# EAGLE design angle_led (EAGLE 9.6.2)
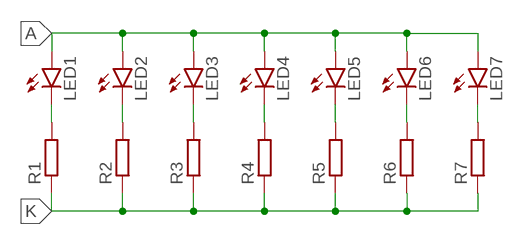
[diagram p0: schematic, sheet 1]

## Parts
LED1  LED5MM  [LED5MM]
LED2  LED5MM  [LED5MM]
LED3  LED5MM  [LED5MM]
LED4  LED5MM  [LED5MM]
LED5  LED5MM  [LED5MM]
LED6  LED5MM  [LED5MM]
LED7  LED5MM  [LED5MM]
R1  R-EU_R0603  [R0603]
R2  R-EU_R0603  [R0603]
R3  R-EU_R0603  [R0603]
R4  R-EU_R0603  [R0603]
R5  R-EU_R0603  [R0603]
R6  R-EU_R0603  [R0603]
R7  R-EU_R0603  [R0603]

## Nets
A: LED1.A LED2.A LED3.A LED4.A LED5.A LED6.A LED7.A
K: R1.1 R2.1 R3.1 R4.1 R5.1 R6.1 R7.1
N$1: LED1.K(C) R1.2
N$2: LED2.K(C) R2.2
N$3: LED3.K(C) R3.2
N$4: LED4.K(C) R4.2
N$5: LED5.K(C) R5.2
N$6: LED6.K(C) R6.2
N$7: LED7.K(C) R7.2

## Library data of the parts
LED1-LED7 = led:LED: LED OSRAM: - CHIPLED LG R971, LG N971, LY N971, LG Q971, LY Q971, LO R971, LY R971 LH N974, LH R974 LS Q976, LO Q976, LY Q976 LO Q996 - Hyper CHIPLED LW Q18S LB Q993, LB Q99A, LB R99A - SideLED LS A670, LO A670, LY A670, LG A670, LP A670 LB A673, LV A673, LT A673, LW A673 LH A674 LY A675 LS A676, LA A676, LO A676, LY A676, LW A676 LS A679, LY A679, LG A679 - Hyper Micro SIDELED® LS Y876, LA Y876, LO Y876, LY Y876 LT Y87S - SmartLED LW L88C, LW L88S LB L89C, LB L89S, LG L890 LS L89K, LO L89K, LY L89K LS L896, LA L896, LO L896, LY L896 - TOPLED LS T670, LO T670, LY T670, LG T670, LP T670 LSG T670, LSP T670, LSY T670, LOP T670, LYG T670 LG T671, LOG T671, LSG T671 LB T673, LV T673, LT T673, LW T673 LH T674 LS T676, LA T676, LO T676, LY T676, LB T676, LH T676, LSB T676, LW T676 LB T67C, LV T67C, LT T67C, LS T67K, LO T67K, LY T67K, LW E67C LS E67B, LA E67B, LO E67B, LY E67B, LB E67C, LV E67C, LT E67C LW T67C LS T679, LY T679, LG T679 LS T770, LO T770, LY T770, LG T770, LP T770 LB T773, LV T773, LT T773, LW T773 LH T774 LS E675, LA E675, LY E675, LS T675 LS T776, LA T776, LO T776, LY T776, LB T776 LHGB T686 LT T68C, LB T68C - Hyper Mini TOPLED® LB M676 - Mini TOPLED Santana® LG M470 LS M47K, LO M47K, LY M47K Source: http://www.osram.convergy.de LUXEON: - LUMILED® LXK2-PW12-R00, LXK2-PW12-S00, LXK2-PW14-U00, LXK2-PW14-V00 LXK2-PM12-R00, LXK2-PM12-S00, LXK2-PM14-U00 LXK2-PE12-Q00, LXK2-PE12-R00, LXK2-PE12-S00, LXK2-PE14-T00, LXK2-PE14-U00 LXK2-PB12-K00, LXK2-PB12-L00, LXK2-PB12-M00, LXK2-PB14-N00, LXK2-PB14-P00, LXK2-PB14-Q00 LXK2-PR12-L00, LXK2-PR12-M00, LXK2-PR14-Q00, LXK2-PR14-R00 LXK2-PD12-Q00, LXK2-PD12-R00, LXK2-PD12-S00 LXK2-PH12-R00, LXK2-PH12-S00 LXK2-PL12-P00, LXK2-PL12-Q00, LXK2-PL12-R00 Source: www.luxeon.com KINGBRIGHT: KA-3528ASYC Source: www.kingbright.com
R1-R7 = rcl:R-EU_: RESISTOR, European symbol; SPICEPREFIX: R

## Board
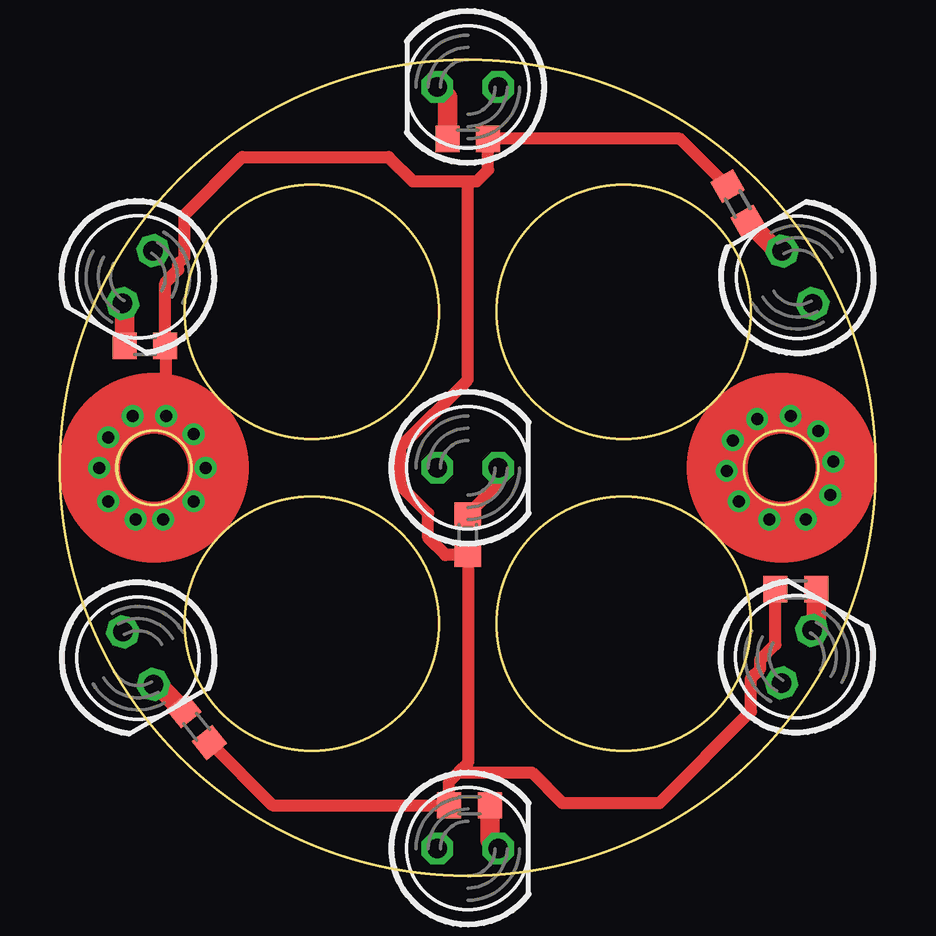
[diagram p1: board, top side]
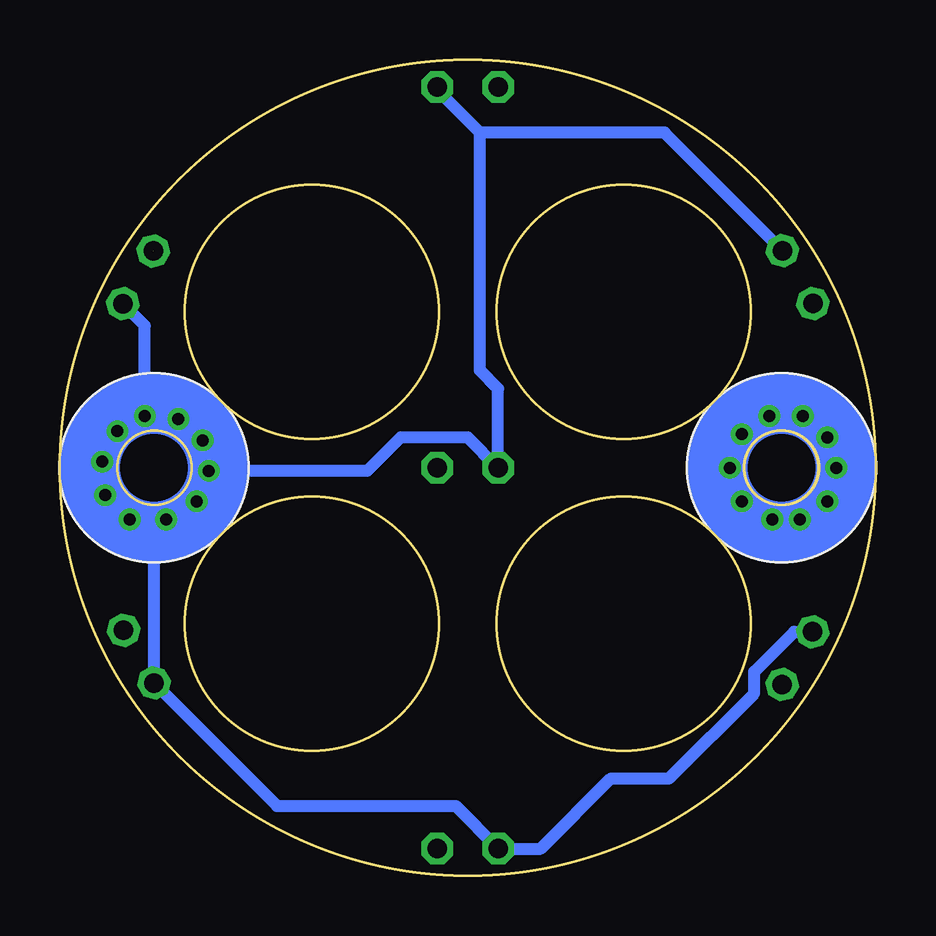
[diagram p2: board, bottom side, seen from below]

Size 34 x 34 mm. Coordinates in mm from the lower left corner, seen from the top.
Outline: circle at 30.06,17 radius 1.55
Outline: circle at 3.94,17 radius 1.55
Outline: circle at 10.5,23.5 radius 5.3
Outline: circle at 23.5,23.5 radius 5.3
Outline: circle at 10.5,10.5 radius 5.3
Outline: circle at 23.5,10.5 radius 5.3
Outline: circle at 17,17 radius 17
Outline: circle at 3.9,17 radius 1.55
Outline: circle at 30.06,17 radius 1.55
Copper layers (1*16): Top 0.035mm / dielectric 1.5mm / Bottom 0.035mm
Design rules "default *": minimum track width 6mil, minimum drill 0.35mm, track to track 6mil, track to pad 6mil, pad to pad 6mil, via to via 6mil, smd to smd 6mil, copper to edge 6mil, drill to drill 6mil, minimum pad ring 10mil, minimum via ring 8mil, stop-mask expansion 4mil, vias tented up to drill 0mil, thermal gap 10mil

### Footprints (pad centres in the part's own frame; a part is rotated, then mirrored left to right if it is on the bottom)
LED5MM = drill 0.813 octagon: A -1.27,0; K 1.27,0
R0603 = smd 1 x 1.1: 1 -0.85,0; 2 0.85,0

### Placement (x,y rotation side)
LED1  17,1.12 0 top
LED2  30.72,9.13 60 top
LED3  30.74,24.94 120 top
LED4  17,32.88 180 top
LED5  3.25,24.95 240 top
LED6  3.26,9.06 300 top
LED7  17,17 0 top
R1  17.08,2.93 0 top
R2  30.68,11.93 0 top
R3  28.26,28 300 top
R4  17,30.72 180 top
R5  3.54,22.08 180 top
R6  5.7,6.21 129 top
R7  17,14.21 90 top

### Tracks (layer width: path | path; a pad name or v marks a point on that pad's centre or on a via)
A  (via drill 0.5 pad 0.6)
  Top 0.508: v27.8,16.87 27.8,16.11 v28.3,15.6 | v29.57,14.84 v31.1,14.84 | v32.11,15.86 32.11,17.13 v32.24,17.25 | v31.61,18.52 30.97,19.16 v30.46,19.16 | v29.06,19.03 28.18,18.14 v28.05,18.14
  Bottom 0.508: v28.3,15.6 29.06,14.84 v29.57,14.84 30.08,14.33 LED2.A 24.96,2.9 17.51,2.9 LED1.A 13.95,1.12 11.03,4.05 8.62,4.05 5.06,7.6 5.06,8.49 3.39,10.16 LED6.A | v31.1,14.84 v32.11,15.86 | v32.24,17.25 32.24,17.89 v31.61,18.52 | v29.06,19.03 29.19,19.16 v30.46,19.16 30.46,22.92 LED3.A | LED5.A 8.8,30.97 16.49,30.97 | 16.49,30.97 18.27,32.75 LED4.A | 16.49,30.97 16.49,21.06 15.73,20.3 LED7.A 17,18.27 19.79,18.27 21.19,16.87 v27.8,16.87
K  (via drill 0.5 pad 0.6)
  Top 0.508: R6.1 8.85,2.93 R1.1 16.23,3.91 16.62,4.3 | R2.1 29.83,9.63 29.19,9 29.19,8.62 28.81,8.24 28.81,6.84 25,3.03 20.94,3.03 19.67,4.3 16.62,4.3 | 16.62,4.3 17,4.68 R7.1 16.07,13.36 15.35,14.08 15.35,15.1 14.21,16.24 14.21,17.89 17,20.68 17,28.94 | R3.1 25.85,30.72 R4.1 17.85,29.41 17.38,28.94 17,28.94 | 17,28.94 14.71,28.94 13.7,29.95 7.6,29.95 5.19,27.54 5.19,25.76 4.94,25.51 4.94,25.26 4.39,24.71 R5.1 4.43,22.04 v4.43,19.16 4.81,19.16 v5.57,18.4 | v6.08,17 6.08,16.11 v5.57,15.6 | v4.3,14.84 v3.16,14.84 | v2.01,15.6 1.63,15.98 v1.63,17 | v2.01,18.27 2.9,19.16 v3.03,19.16
  Bottom 0.508: v5.57,18.4 6.08,17.89 v6.08,17 | v5.57,15.6 4.81,14.84 v4.3,14.84 | v3.16,14.84 2.78,14.84 v2.01,15.6 | v1.63,17 1.63,17.89 v2.01,18.27
N$1
  Top 0.813: LED1.K 17.93,1.47 R1.2
N$2
  Top 0.813: LED2.K 31.53,10.4 R2.2
N$3  (1 unrouted)
  Top 0.813: LED3.K 29.91,26.04 R3.2
N$4
  Top 0.813: R4.2 16.15,32.45 LED4.K
N$5
  Top 0.813: R5.2 2.69,23.77 LED5.K
N$6
  Top 0.813: LED6.K 4.06,7.96 R6.2
N$7
  Top 0.508: R7.2 18.27,16.33 LED7.K
(copper drawn outside any net)
  shapes: Bottom circle x2, Top circle x2